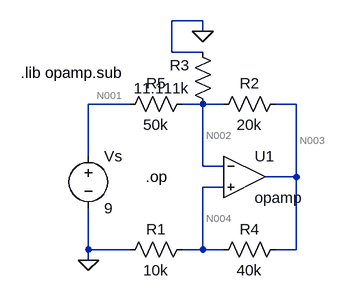
[diagram p0: schematic pag7es12p1.asc]
pag7es12p1.asc, the LTspice schematic file:
Version 4
SHEET 1 880 680
WIRE 240 -128 192 -128
WIRE 240 -112 240 -128
WIRE 192 -80 192 -128
WIRE 240 -80 192 -80
WIRE 128 0 64 0
WIRE 240 0 208 0
WIRE 272 0 240 0
WIRE 384 0 352 0
WIRE 64 80 64 0
WIRE 240 96 240 0
WIRE 272 96 240 96
WIRE 384 112 384 0
WIRE 384 112 336 112
WIRE 272 128 240 128
WIRE 64 224 64 160
WIRE 128 224 64 224
WIRE 240 224 240 128
WIRE 240 224 208 224
WIRE 272 224 240 224
WIRE 384 224 384 112
WIRE 384 224 352 224
WIRE 64 240 64 224
FLAG 64 240 0
FLAG 240 -112 0
SYMBOL voltage 64 64 R0
SYMATTR InstName Vs
SYMATTR Value 9
SYMBOL res 112 16 R270
WINDOW 0 32 56 VTop 2
WINDOW 3 0 56 VBottom 2
SYMATTR InstName R5
SYMATTR Value 50k
SYMBOL res 256 16 R270
WINDOW 0 32 56 VTop 2
WINDOW 3 0 56 VBottom 2
SYMATTR InstName R2
SYMATTR Value 20k
SYMBOL OpAmps\\opamp 304 48 R0
SYMATTR InstName U1
SYMBOL res 224 208 R90
WINDOW 0 0 56 VBottom 2
WINDOW 3 32 56 VTop 2
SYMATTR InstName R1
SYMATTR Value 10k
SYMBOL res 368 208 R90
WINDOW 0 0 56 VBottom 2
WINDOW 3 32 56 VTop 2
SYMATTR InstName R4
SYMATTR Value 40k
SYMBOL res 256 16 R180
WINDOW 0 36 76 Left 2
WINDOW 3 36 40 Left 2
SYMATTR InstName R3
SYMATTR Value 11.111k
TEXT -40 -48 Left 2 !.lib opamp.sub
TEXT 152 112 Left 2 !.op

The netlist it stands for:
* pag7es12p1.asc
Vs N001 0 9
R5 N001 N002 50k
R2 N002 N003 20k
XU1 N002 N004 N003 opamp Aol=100K GBW=10Meg  ; pins invin noninvin out
R1 N004 0 10k
R4 N003 N004 40k
R3 N002 0 11.111k
.lib opamp.sub
.op
.backanno
.end

* Results of the author's LTspice run, read from the files saved beside the schematic
* Operating Point:
*   V(n001) = 9 V
*   V(n002) = -2 V
*   V(n003) = -9.999 V
*   V(n004) = -2 V
*   I(R3) = -180 µA
*   I(R4) = -200 µA
*   I(R1) = -200 µA
*   I(R2) = 400 µA
*   I(R5) = 220 µA
*   I(Vs) = -220 µA
*   Ix(u1:3) = 600 µA